# EAGLE design v2164 quad VC mixer w ext in 0402 DIL (EAGLE 9.5.2)
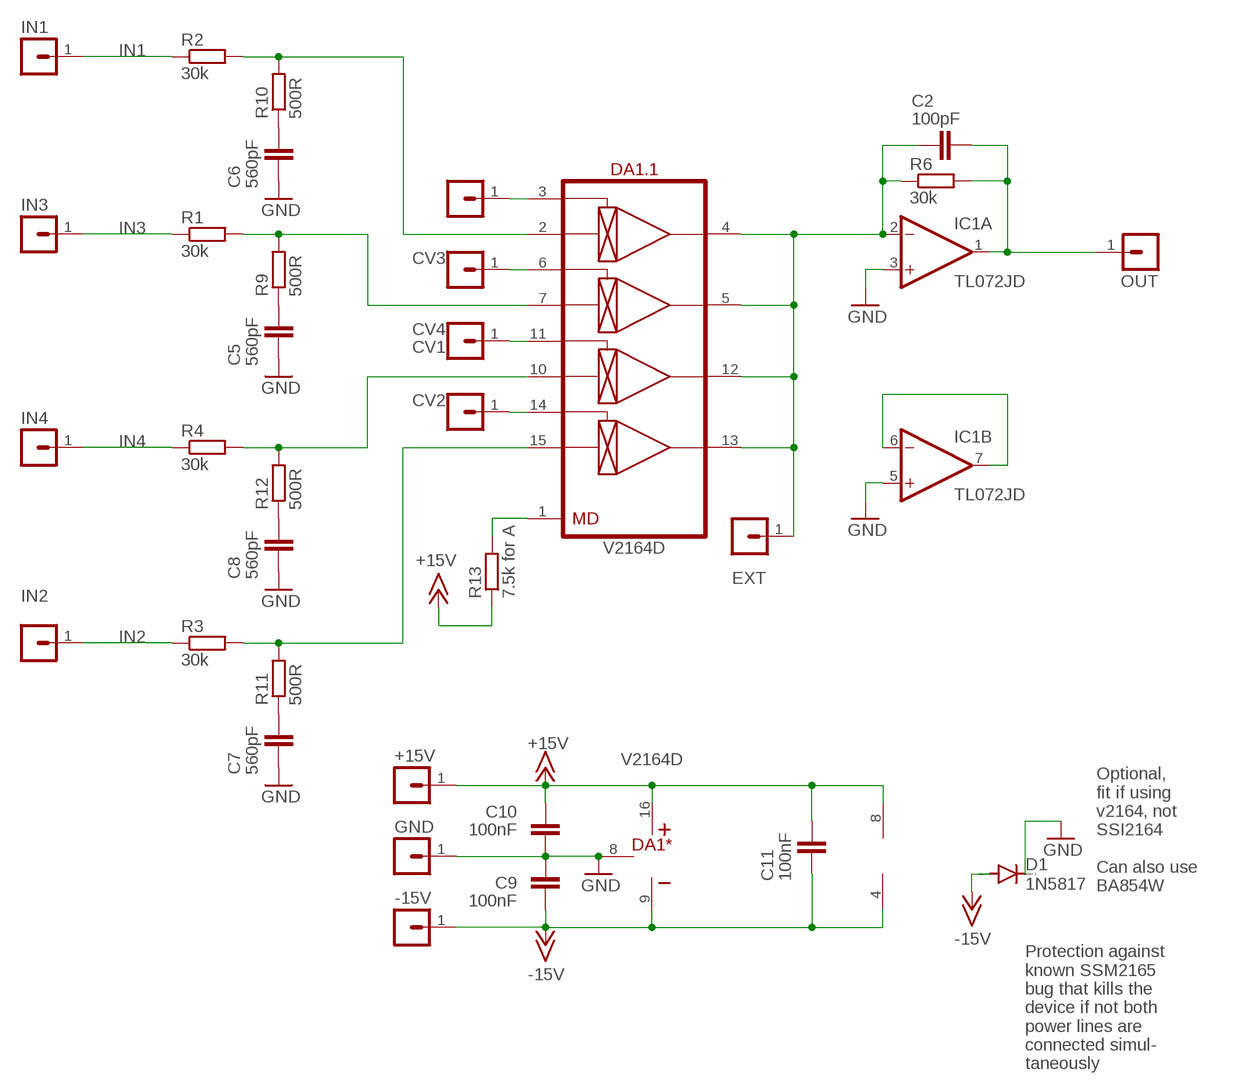
[diagram p0: schematic, sheet 1]

## Parts
+15V  MA01-1JP  [SIP-PIN01-1J]
-15V  MA01-1JP  [SIP-PIN01-1J]
C2  100pF  C-EUC0402  [C0402]
C5  560pF  C-EUC0603  [C0603]
C6  560pF  C-EUC0603  [C0603]
C7  560pF  C-EUC0603  [C0603]
C8  560pF  C-EUC0603  [C0603]
C9  100nF  C-EUC0402  [C0402]
C10  100nF  C-EUC0402  [C0402]
C11  100nF  C-EUC0402  [C0402]
CV1  MA01-1JP  [SIP-PIN01-1J]
CV2  MA01-1JP  [SIP-PIN01-1J]
CV3  MA01-1JP  [SIP-PIN01-1J]
CV4  MA01-1JP  [SIP-PIN01-1J]
D1  1N5817  DIODE-SOD323-R  [SOD323-R]
DA1  V2164D  [DIP-16]
EXT  MA01-1JP  [SIP-PIN01-1J]
GND  MA01-1JP  [SIP-PIN01-1J]
IC1  TL072JD  [SO08J]
IN1  MA01-1JP  [SIP-PIN01-1J]
IN2  MA01-1JP  [SIP-PIN01-1J]
IN3  MA01-1JP  [SIP-PIN01-1J]
IN4  MA01-1JP  [SIP-PIN01-1J]
OUT  MA01-1JP  [SIP-PIN01-1J]
R1  30k  R-EU_R0402  [R0402]
R2  30k  R-EU_R0402  [R0402]
R3  30k  R-EU_R0402  [R0402]
R4  30k  R-EU_R0402  [R0402]
R6  30k  R-EU_R0402  [R0402]
R9  500R  R-EU_R0402  [R0402]
R10  500R  R-EU_R0402  [R0402]
R11  500R  R-EU_R0402  [R0402]
R12  500R  R-EU_R0402  [R0402]
R13  7.5k for A  R-EU_R0402  [R0402]

## Nets
+15V: +15V.1 C10.2 C11.2 DA1.16(*:V+) IC1.8(P:V+) R13.1
-15V: -15V.1 C9.1 C11.1 D1.A DA1.9(*:V-) IC1.4(P:V-)
GND: C5.1 C6.1 C7.1 C8.1 C9.2 C10.1 D1.C DA1.8(*:GND) GND.1 IC1.3(A:+IN) IC1.5(B:+IN)
IN1: IN1.1 R2.1
IN2: IN2.1 R3.1
IN3: IN3.1 R1.1
IN4: IN4.1 R4.1
N$2: DA1.1(.1:MD) R13.2
N$4: CV1.1 DA1.3(.1:CV1)
N$6: CV3.1 DA1.6(.1:CV2)
N$8: CV2.1 DA1.14(.1:CV4)
N$9: C5.2 R9.1
N$10: C6.2 R10.1
N$11: C7.2 R11.1
N$12: C8.2 R12.1
N$13: CV4.1 DA1.11(.1:CV3)
N$14: C2.1 DA1.4(.1:OUT1) DA1.5(.1:OUT2) DA1.12(.1:OUT3) DA1.13(.1:OUT4) EXT.1 IC1.2(A:-IN) R6.1
N$17: DA1.7(.1:IN2) R1.2 R9.2
N$18: DA1.2(.1:IN1) R2.2 R10.2
N$19: DA1.15(.1:IN4) R3.2 R11.2
N$20: DA1.10(.1:IN3) R4.2 R12.2
OUT3: C2.2 IC1.1(A:OUT) OUT.1 R6.2
OUT4: IC1.6(B:-IN) IC1.7(B:OUT)

## Notes on the sheet
- Optional,
  fit if using
  v2164, not
  SSI2164
  
  Can also use
  BA854W
- Protection against
  known SSM2165
  bug that kills the
  device if not both
  power lines are 
  connected simul-
  taneously

## Library data of the parts
+15V -15V CV1-CV4 EXT GND IN1-IN4 OUT = joakim:MA01-1J: PIN HEADER
C2 C5-C11 = rcl:C-EU: CAPACITOR, European symbol; SPICEPREFIX: C
D1 = diode:DIODE-: DIODE
DA1 = ic-coolaudio:V2164
IC1 = joakim:TL072J: OP AMP
R1-R4 R6 R9-R13 = rcl:R-EU_: RESISTOR, European symbol; SPICEPREFIX: R

## Board
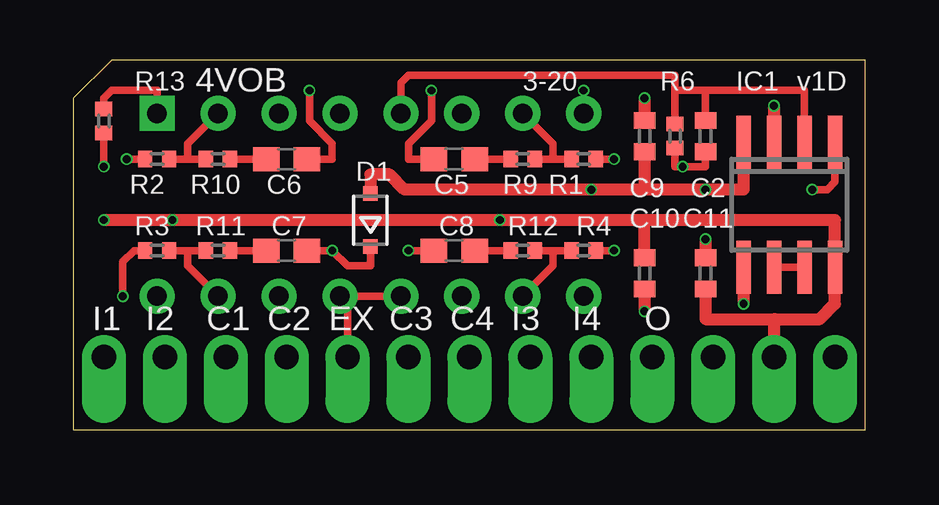
[diagram p1: board, top side]
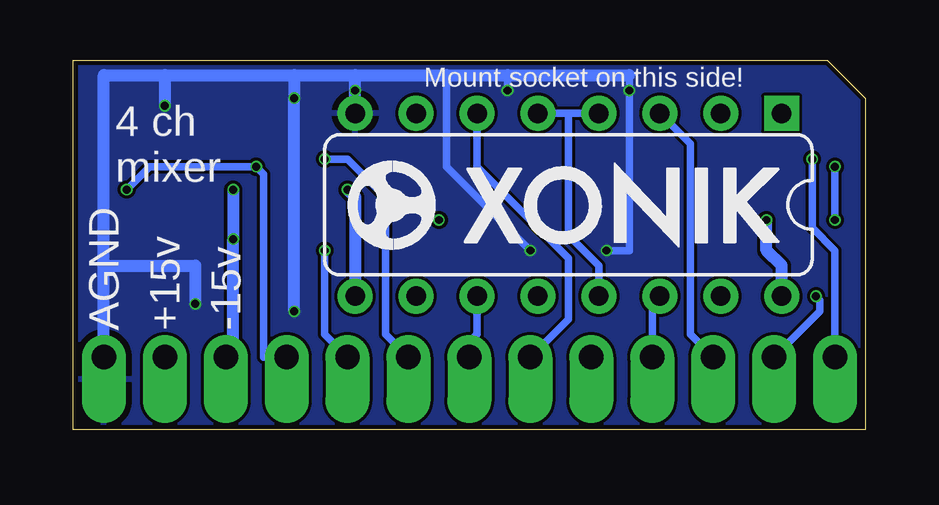
[diagram p2: board, bottom side, seen from below]

Size 33.02 x 15.4 mm. Coordinates in mm from the lower left corner, seen from the top.
Outline: 0,0 33.02,0 33.02,15.4 1.59,15.4 0,13.81 0,0
Copper layers (1*16): Top 0.035mm / dielectric 1.6mm / Bottom 0.035mm
Design rules "jlcpcb-2layers": minimum track width 5mil, minimum drill 0.3mm, track to track 5mil, track to pad 5mil, pad to pad 5mil, via to via 5mil, smd to smd 5mil, copper to edge 0.2mm, drill to drill 6mil, minimum pad ring 10mil, minimum via ring 3mil, stop-mask expansion 4mil, vias tented up to drill 0mil, thermal gap 10mil

### Footprints (pad centres in the part's own frame; a part is rotated, then mirrored left to right if it is on the bottom)
SIP-PIN01-1J = drill 1.016 offset: 1 0,0
C0402 = smd 0.7 x 0.9: 1 -0.65,0; 2 0.65,0
C0603 = smd 1.1 x 1: 1 -0.85,0; 2 0.85,0
SOD323-R = smd 0.6 x 0.6: A 1.1,0; C -1.1,0
DIP-16 = drill 0.813 square: 1 -8.89,-3.81 | drill 0.813: 2 -6.35,-3.81; 3 -3.81,-3.81; 4 -1.27,-3.81; 5 1.27,-3.81; 6 3.81,-3.81; 7 6.35,-3.81; 8 8.89,-3.81; 9 8.89,3.81; 10 6.35,3.81; 11 3.81,3.81; 12 1.27,3.81; 13 -1.27,3.81; 14 -3.81,3.81; 15 -6.35,3.81; 16 -8.89,3.81
SO08J = smd 0.6 x 2.2: 1 -1.905,-2.6; 2 -0.635,-2.6; 3 0.635,-2.6; 4 1.905,-2.6; 5 1.905,2.6; 6 0.635,2.6; 7 -0.635,2.6; 8 -1.905,2.6
R0402 = smd 0.6 x 0.7: 1 -0.5,0; 2 0.5,0

### Placement (x,y rotation side)
+15V  29.21,3.02 0 top
-15V  26.67,3.02 0 top
C2  26.35,12.22 270 top
C5  15.88,11.27 0 top
C6  8.89,11.27 180 top
C7  8.89,7.46 180 top
C8  15.88,7.46 0 top
C9  23.81,12.22 90 top
C10  23.81,6.51 90 top
C11  26.35,6.51 270 top
CV1  6.35,3.02 0 top
CV2  8.89,3.02 0 top
CV3  13.97,3.02 0 top
CV4  16.51,3.02 0 top
D1  12.38,8.73 90 top
DA1  12.38,9.37 180 bottom
EXT  11.43,3.02 0 top
GND  31.75,3.02 0 top
IC1  29.84,9.37 180 top
IN1  1.27,3.02 0 top
IN2  3.81,3.02 0 top
IN3  19.05,3.02 0 top
IN4  21.59,3.02 0 top
OUT  24.13,3.02 0 top
R1  21.27,11.27 180 top
R2  3.49,11.27 0 top
R3  3.49,7.46 0 top
R4  21.27,7.46 180 top
R6  25.08,12.22 270 top
R9  18.73,11.27 0 top
R10  6.03,11.27 180 top
R11  6.03,7.46 180 top
R12  18.73,7.46 0 top
R13  1.27,12.86 90 top
U$1  [XONIK_LOGO_18]  21.59,7.52 0 bottom

### Tracks (layer width: path | path; a pad name or v marks a point on that pad's centre or on a via)
+15V  (via drill 0.33)
  Top 0.305: R13.1 v1.27,10.95
  Top 0.508: 23.81,8.73 31.75,8.73 IC1.8 31.75,5.24 31.11,4.6 29.23,4.6 | 23.81,8.73 v17.78,8.73 v4.13,8.73 v1.27,8.73 | C10.2 23.81,8.73 | 29.23,4.6 29.23,3.03 +15V.1 | 29.23,4.6 26.35,4.6 C11.2
  Bottom 0.305: v1.27,10.95 v1.27,8.73
  Bottom 0.508: DA1.16 3.49,6.83 4.13,7.46 v4.13,8.73
-15V  (via drill 0.33)
  Top 0.508: IC1.4 27.94,10 v26.35,10 23.81,10 | 23.81,10 v21.59,10 13.81,10 13.18,10.64 12.38,10.64 D1.A | C9.1 23.81,10 | v26.35,7.94 C11.1
  Bottom 0.508: v21.59,10 21.27,9.68 DA1.9 | -15V.1 26.35,3.33 v26.35,7.94 v26.35,10
GND  (via drill 0.33)
  Top 0.305: C6.1 10.79,11.27 10.79,11.91 9.84,12.86 v9.84,14.13 | C7.1 v10.79,7.46 11.43,6.83 12.38,6.83 D1.C | C5.1 13.97,11.27 13.97,11.91 14.92,12.86 v14.92,14.13 | C8.1 v13.97,7.46
  Top 0.508: v23.81,13.81 C9.2 | C10.1 v23.81,4.92 | v29.21,13.49 IC1.3 | IC1.5 v27.94,5.24
  Bottom 0.305: 9.84,14.76 v9.84,14.13 9.84,7.46 v10.79,7.46 | v14.92,14.13 14.92,14.76 | v13.97,7.46 17.46,10.95 17.46,14.76
  Bottom 0.508: 29.21,14.76 31.75,14.76 31.75,6.83 | 29.21,14.76 23.81,14.76 | 23.81,14.76 21.27,14.76 | 21.27,14.76 17.46,14.76 14.92,14.76 9.84,14.76 | 21.27,14.76 v21.27,14.13 DA1.8 | 23.81,14.76 v23.81,13.81 v23.81,4.92 | 29.21,14.76 v29.21,13.49 | 31.75,6.83 27.94,6.83 v27.94,5.24 | GND.1 31.75,6.83
  pour Bottom: 0,0 0,15.4 33.02,15.4 33.02,0
IN1  (via drill 0.33)
  Top 0.305: v2.22,11.27 R2.1
  Bottom 0.305: IN1.1 1.27,7.46 2.22,8.41 v2.22,11.27
IN2  (via drill 0.33)
  Top 0.305: R3.1 2.54,7.46 2.06,6.99 v2.06,5.56
  Bottom 0.305: v2.06,5.56 1.91,5.4 1.91,4.92 IN2.1
IN3  (via drill 0.33)
  Top 0.305: v22.54,11.27 R1.1
  Bottom 0.305: v22.54,11.27 21.59,11.27 20,9.68 20,3.97 IN3.1
IN4  (via drill 0.33)
  Top 0.305: R4.1 v22.54,7.46
  Bottom 0.305: IN4.1 22.54,3.97 v22.54,7.46
N$2
  Top 0.305: DA1.1 3.49,14.13 1.59,14.13 1.27,13.81 R13.2
N$4
  Bottom 0.305: DA1.3 7.3,11.91 7.3,3.97 CV1.1
N$6
  Bottom 0.305: DA1.6 16.19,10.95 12.38,7.14 12.38,4.6 CV3.1
N$8
  Bottom 0.305: CV2.1 8.89,5.24 DA1.14
N$9
  Top 0.305: R9.1 C5.2
N$10
  Top 0.305: R10.1 C6.2
N$11
  Top 0.305: C7.2 R11.1
N$12
  Top 0.305: R12.1 C8.2
N$13
  Bottom 0.305: DA1.11 16.19,3.97 17.14,3.02 CV4.1
N$14
  Top 0.305: 26.35,14.13 25.08,14.13 | 25.08,14.13 R6.1 | C2.1 26.35,14.13 | IC1.2 30.48,14.13 26.35,14.13 | 25.08,14.13 25.08,14.76 13.97,14.76 13.65,14.45 DA1.5 | DA1.13 11.43,5.56 | 11.43,5.56 DA1.12 | EXT.1 11.43,5.56
  Bottom 0.305: DA1.13 11.11,6.83 12.38,8.1 12.38,13.18 | 12.38,13.18 DA1.4 | DA1.5 12.38,13.18
N$17
  Top 0.305: R1.2 20,11.27 | 20,11.27 R9.2 | 20,11.27 20,11.91 DA1.7
N$18
  Top 0.305: R2.2 4.76,11.27 | 4.76,11.27 R10.2 | 4.76,11.27 4.76,11.91 DA1.2
N$19
  Top 0.305: R11.2 4.76,7.46 | 4.76,7.46 R3.2 | DA1.15 4.76,6.83 4.76,7.46
N$20
  Top 0.305: R4.2 20,7.46 | 20,7.46 R12.2 | DA1.10 20,6.83 20,7.46
OUT3  (via drill 0.33)
  Top 0.305: R6.2 25.08,10.95 v25.4,10.95 26.35,10.95 C2.2 | IC1.1 31.75,10.32 31.43,10 v30.8,10
  Bottom 0.305: v30.8,10 29.84,10.95 v25.4,10.95 25.08,10.64 25.08,3.02 OUT.1
OUT4
  Top 0.305: IC1.7 IC1.6

### Text on the board
tNames: 4VOB | 3-20 | v1D | I1 | I2 | C1 | C2 | EX | C3 | C4 | I3 | I4 | O
bNames: Mount socket on this side! | 4 ch / mixer | -15v | +15v | AGND